# Altium schematic sheet Sheet6.SchDoc
size A4
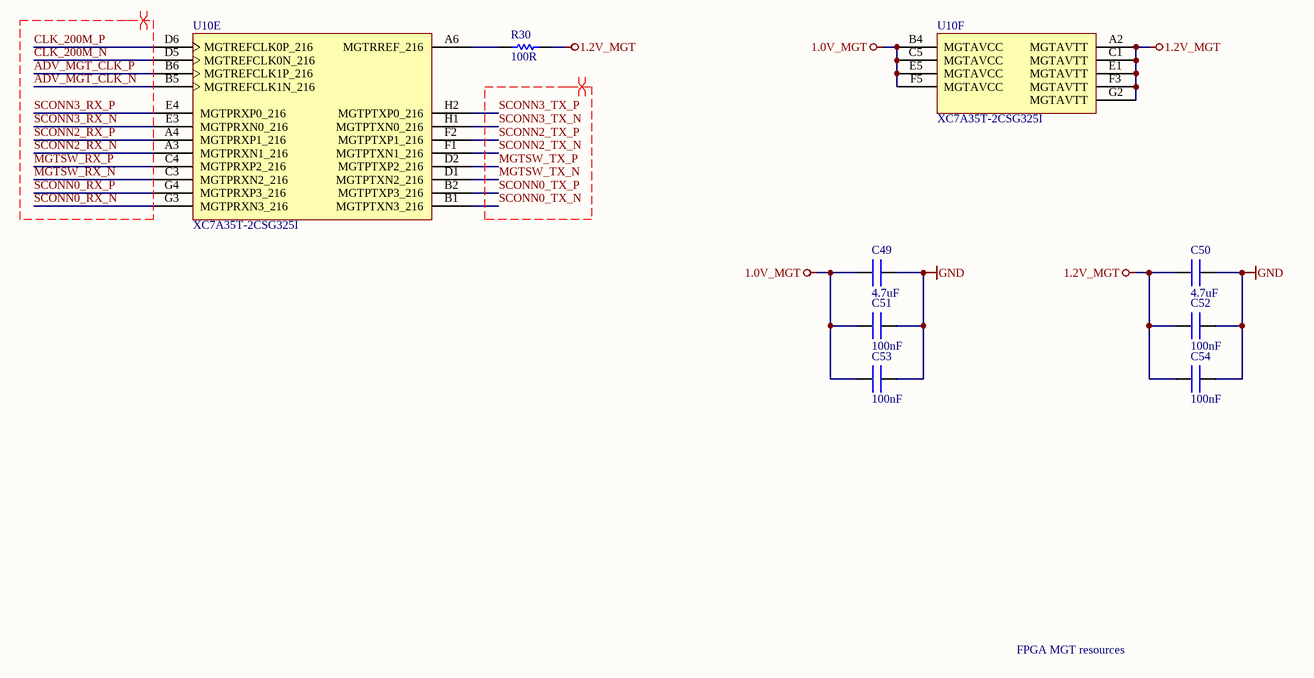
[diagram p0: Sheet6.SchDoc]

## Parts
C49  4.7uF  [CAPC1608X08N]
C50  4.7uF  [CAPC1608X08N]
C51  100nF  [CAPC1005X05L]
C52  100nF  [CAPC1005X05L]
C53  100nF  [CAPC1005X05L]
C54  100nF  [CAPC1005X05L]
R30  100R  [RESC1005X05N]
U10  XC7A35T-2CSG325I  [XC7A35T-2CSG325I]  (parts E,F of 9)

## Nets
1.0V_MGT: C49.2 C51.2 C53.2 U10.B4(MGTAVCC) U10.C5(MGTAVCC) U10.E5(MGTAVCC) U10.F5(MGTAVCC)
1.2V_MGT: C50.2 C52.2 C54.2 R30.1 U10.A2(MGTAVTT) U10.C1(MGTAVTT) U10.E1(MGTAVTT) U10.F3(MGTAVTT) U10.G2(MGTAVTT)
GND: C49.1 C50.1 C51.1 C52.1 C53.1 C54.1
ADV_MGT_CLK_N: U10.B5(MGTREFCLK1N_216)
ADV_MGT_CLK_P: U10.B6(MGTREFCLK1P_216)
CLK_200M_N: U10.D5(MGTREFCLK0N_216)
CLK_200M_P: U10.D6(MGTREFCLK0P_216)
MGTSW_RX_N: U10.C3(MGTPRXN2_216)
MGTSW_RX_P: U10.C4(MGTPRXP2_216)
MGTSW_TX_N: U10.D1(MGTPTXN2_216)
MGTSW_TX_P: U10.D2(MGTPTXP2_216)
SCONN0_RX_N: U10.G3(MGTPRXN3_216)
SCONN0_RX_P: U10.G4(MGTPRXP3_216)
SCONN0_TX_N: U10.B1(MGTPTXN3_216)
SCONN0_TX_P: U10.B2(MGTPTXP3_216)
SCONN2_RX_N: U10.A3(MGTPRXN1_216)
SCONN2_RX_P: U10.A4(MGTPRXP1_216)
SCONN2_TX_N: U10.F1(MGTPTXN1_216)
SCONN2_TX_P: U10.F2(MGTPTXP1_216)
SCONN3_RX_N: U10.E3(MGTPRXN0_216)
SCONN3_RX_P: U10.E4(MGTPRXP0_216)
SCONN3_TX_N: U10.H1(MGTPTXN0_216)
SCONN3_TX_P: U10.H2(MGTPTXP0_216)
NetR30_2: R30.2 U10.A6(MGTRREF_216)

## Layout directives
differential pair: ADV_MGT_CLK_N, ADV_MGT_CLK_P, CLK_200M_N, CLK_200M_P, MGTSW_RX_N, MGTSW_RX_P, MGTSW_TX_N, MGTSW_TX_P, SCONN0_RX_N, SCONN0_RX_P, SCONN0_TX_N, SCONN0_TX_P, SCONN2_RX_N, SCONN2_RX_P, SCONN2_TX_N, SCONN2_TX_P, SCONN3_RX_N, SCONN3_RX_P, SCONN3_TX_N, SCONN3_TX_P

## Notes on the sheet
- FPGA MGT resources

## Library data of the parts
C49 C50 = C0603: Ceramic Chip Capacitor; Value: 4.7uF
C51-C54 = C0402: Ceramic Chip Capacitor; Value: 100nF
R30 = R0402: Ceramic Chip Resistor; Value: 100R
U10 = XC7A35T-2CSG325I: Artix-7 FPGA, 150 User I/Os, 4 GTP, 324-Ball BGA, Speed Grade 2, Industrial Grade, Pb-Free; Manufacturer: Xilinx; Total Block RAM: 1800 Kb; GTP: 4; Clock Mgmt Tiles (CMTs): 5; Logic Cells: 33280; Available User I/O: 150; Speed Grades: 2; DatasheetVersion: v1.15; PackageVersion: Rev. 1.11; PackageReference: CSG-325; PackageDescription: 324-Ball Wire-Bond Chip-Scale BGA, Body 15 x 15 mm, Pitch 0.8 mm; Maximum Distributed RAM: 400 Kb; Operating Temperature Range: Industrial; NexusDeviceID: XC7A35T-2CSG325I; Mounting Technology: Surface Mount; PartNumber: XC7A35T-2CSG325I; ComponentLink1Description: Manufacturer URL; ComponentLink1URL: http://www.xilinx.com/; ComponentLink2Description: Datasheet; ComponentLink2URL: http://www.xilinx.com/support/documentation/data_sheets/ds180_7Series_Overview.pdf; ComponentLink3Description: Package Specification; ComponentLink3URL: http://www.xilinx.com/support/documentation/user_guides/ug475_7Series_Pkg_Pinout.pdf; ComponentLink4Description: DC and Switching Characteristics; ComponentLink4URL: http://www.xilinx.com/support/documentation/data_sheets/ds181_Artix_7_Data_Sheet.pdf; ComponentLink5Description: Package File; ComponentLink5URL: http://www.xilinx.com/support/packagefiles/a7packages/xc7a200tsbg484pkg.txt; ComponentLink6Description: Packaging and Pinout; ComponentLink6URL: http://www.xilinx.com/support/documentation/user_guides/ug475_7Series_Pkg_Pinout.pdf